# EAGLE schematic osi-power_dc_rev_0 (EAGLE 6.3)
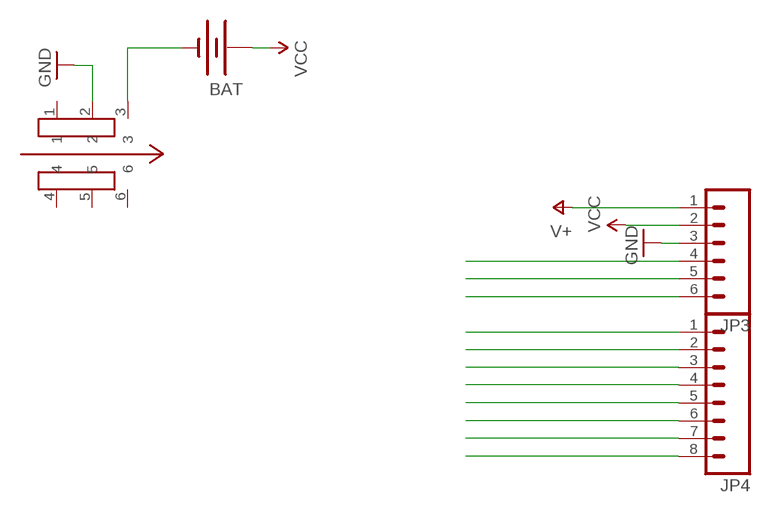
[diagram p0: schematic, sheet 1]

## Parts
BAT  BATTERY20PTH  [BATTCOM_20MM_PTH]
JP3  M06SIP  [1X06]
JP4  M081X08  [1X08]
U$1  SWITCH  [SWITCH]

## Nets
D0: JP4.8
D1: JP4.7
D2: JP4.6
D3: JP4.5
D4: JP4.4
D5: JP4.3
D6: JP4.2
D7: JP4.1
D8: JP3.4
D9: JP3.5
D10: JP3.6
GND: JP3.3 U$1.2
N$1: BAT.2(-) U$1.3
V+: JP3.1
VCC: BAT.1(+) JP3.2
Unconnected: U$1.1 U$1.4 U$1.5 U$1.6

## Library data of the parts
BAT = SparkFun_mod:BATTERY: Battery Holders Various common sizes : AA, AAA, 20mm coin cell and 12mm coin cell.
JP3 = SparkFun_mod:M06: Header 6 Standard 6-pin 0.1" header. Use with straight break away headers (SKU : PRT-00116), right angle break away headers (PRT-00553), swiss pins (PRT-00743), machine pins (PRT-00117), and female headers (PRT-00115). Molex polarized connector foot print use with SKU : PRT-08094 with associated crimp pins and housings. NOTES ON THE VARIANTS LOCK and LOCK_LONGPADS... This footprint was designed to help hold the alignment of a through-hole component (i.e. 6-pin header) while soldering it into place. You may notice that each hole has been shifted either up or down by 0.005 of an inch from it's more standard position (which is a perfectly straight line). This slight alteration caused the pins (the squares in the middle) to touch the edges of the holes. Because they are alternating, it causes a "brace" to hold the component in place. 0.005 has proven to be the perfect amount of "off-center" position when using our standard breakaway headers. Although looks a little odd when you look at the bare footprint, once you have a header in there, the alteration is very hard to notice. Also, if you push a header all the way into place, it is covered up entirely on the bottom side. This idea of altering the position of holes to aid alignment will be further integrated into the Sparkfun Library for other footprints. It can help hold any component with 3 or more connection pins.
JP4 = SparkFun_mod:M08: Header 8 Standard 8-pin 0.1" header. Use with straight break away headers (SKU : PRT-00116), right angle break away headers (PRT-00553), swiss pins (PRT-00743), machine pins (PRT-00117), and female headers (PRT-00115).
U$1 = _my-parts:SWITCH: JS202011AQN DPDT